# Altium schematic sheet misc_comp.SchDoc
size A4
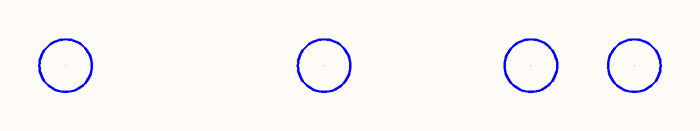
[diagram p0: misc_comp.SchDoc]

## Parts
M1  3mm Mounting Hole  [3mm Mounting Hole]  (value not drawn)
M2  3mm Mounting Hole  [3mm Mounting Hole]  (value not drawn)
M3  3mm Mounting Hole  [3mm Mounting Hole]  (value not drawn)
M4  3mm Mounting Hole  [3mm Mounting Hole]  (value not drawn)

## Nets

Not connected (* = marked no-connect by the designer): M1 1; M2 1; M3 1; M4 1